# Altium project Optical Compressor.PrjPcb (part 2 of 2)

## Sheet Power.SchDoc
size A4; SheetNumber: 5; SheetTotal: 7; SPICEModelCacheJCDLMQBD: <root> / <DocumentId>JCDLMQBD</DocumentId> / </root>
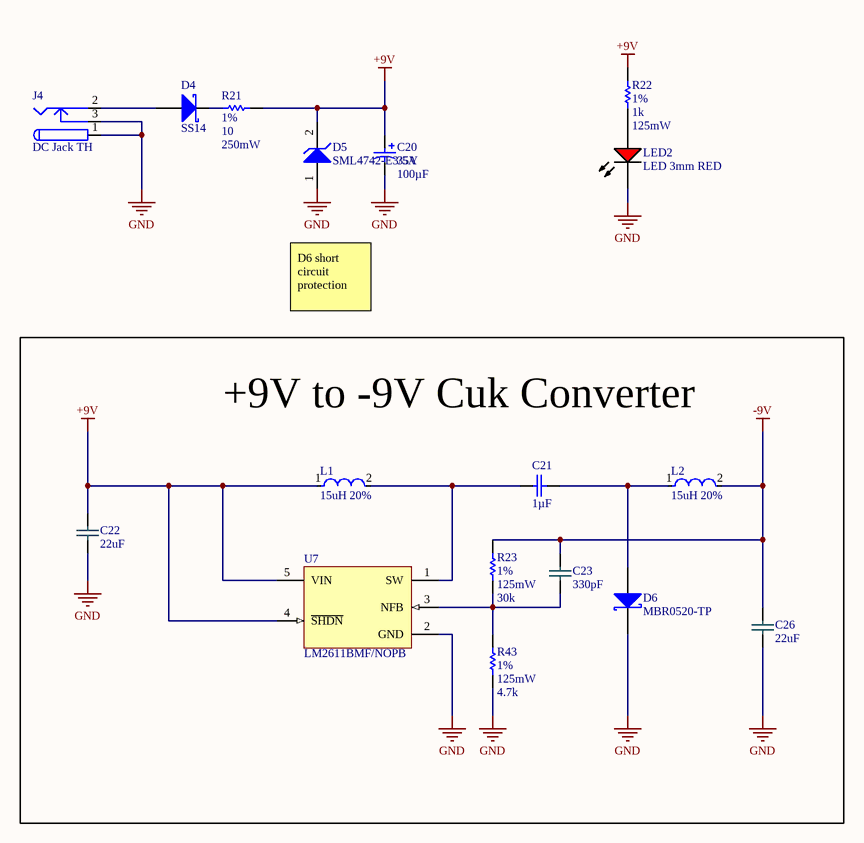
[diagram p4: Power.SchDoc]

### Parts
C20  Rated Voltage: 35V  Capacitance: 100µF  [E-CAP, SMT, diameter 6.3mm, height 7.7mm]  (hidden comment: Cap pol 100µF 35V)
C21  Capacitance: 1µF  [0805-CAP]  (hidden comment: Cap 1µF 0805 X7R)
C22  value 22uF  [1206-CAP]  (hidden comment: Cap 1206 22uF)
C23  value 330pF  [0603-CAP]  (hidden comment: Cap 0603 330pF)
C26  value 22uF  [1206-CAP]  (hidden comment: Cap 1206 22uF)
D4  SS14  [SS14]
D5  SML4742-E3/5A  [DO-214AC]
D6  MBR0520-TP  [SODFL370X135-2N]
J4  DC Jack TH  [DC_Jack]
L1  15uH 20%  [1210 SMD Cap]
L2  15uH 20%  [1210 SMD Cap]
LED2  LED 3mm RED  [KING-WP710A10QBCD_V]
R21  Tolerance (+-): 1%  Resistance: 10  Power: 250mW  [1206-RES]  (hidden comment: Res 10R 1% 1206)
R22  Tolerance (+-): 1%  Resistance: 1k  Power: 125mW  [0805-RES]  (hidden comment: Res 1k 1% 0805)
R23  Tolerance (+-): 1%  Power: 125mW  Resistance: 30k  [0805-RES]  (hidden comment: Res 30k 1% 0805)
R43  Tolerance (+-): 1%  Power: 125mW  Resistance: 4.7k  [0805-RES]  (hidden comment: Res 4.7k 1% 0805)
U7  LM2611BMF/NOPB  [DBV0005A_M]

### Blocks framed on the sheet
+9V to -9V Cuk Converter: C21-C23 C26 D6 L1 L2 R23 R43 U7

### Nets
+9V: C20.1 C22.2 D5.2 L1.1 R21.2 R22.2 U7.4(~{SHDN}) U7.5(VIN)
-9V: C23.2 C26.2 L2.2 R23.2
GND: C20.2 C22.1 C26.1 D5.1 D6.2(K) J4.1 J4.3 LED2.2(K) R43.2 U7.2(GND)
NetC21_1: C21.1 L1.2 U7.1(SW)
NetC21_2: C21.2 D6.1(A) L2.1
NetC23_1: C23.1 R23.1 R43.1 U7.3(NFB)
NetD4_A: D4.A J4.2
NetD4_K: D4.K R21.1
NetLED2_1: LED2.1(A) R22.1

### Notes on the sheet
- D6 short circuit protection

### Library data of the parts
C20 = CMP-00119-4: Cap Aluminum 100uF 35V ±20% (6.3x7.7mm) SMD 2000h 85°C; Lifetime @ Max. Temp. (hours): 2000h; - Tolerance: 20%; + Tolerance: 20%; Maximum operating temperature: 85°C
C21 = CMP-04113-3: Cap 1µF 0805 X7R 50V +-10%; Tolerance (+-): 10%; Dielectric: X7R; Maximum operating temperature: 125°C; Height: 1.45mm; Size (Imperial): 0805; Rated Voltage: 50V
C22 C26 = CMP-019-0043-11: 22uF, 25V, X5R, 20%; Source: main.SchLib; Mount: Surface Mount; Tolerance: 20%; Case/Package: 1206; Min Operating Temperature: -55°C; Voltage Rating: 25V; Length: 0.126inch; Voltage Rating (DC): 25V; Thickness: 0.02inch; Dielectric: X5R; Stock 1: 409; Packaging: Tape and Reel; Capacitance: 22uF; Case Code (Metric): 3216; RoHS: Yes; Width: 0.063inch; Max Operating Temperature: 85°C; Case Code (Imperial): 1206; Pricing 1: 1 = 0.72000, 10 = 0.51900, 50 = 0.51900, 100 = 0.34200, 1000 = 0.21500, 10000 = 0.15900 (USD); Design Item ID: Cap 1206 22uF
C23 = CMP-019-0066-14: 330pF,  5%,  50V,  C0G; Dielectric Material: Ceramic; Temperature Coefficient: 30ppm/°C; Dissipation Factor: 0.5%; Tolerance: 5%; REACH SVHC: No SVHC; RoHS: Yes; Contact Material: Tin; Height: 0.8mm; Package Quantity: 1; ComponentLink5URL: https://datasheet.ciiva.com/14597/70095383-14597551.pdf?src-supplier=Allied+Electronics; Width: 0.8mm; Lead Pitch: 0.7mm; ComponentLink2Description: https://datasheet.ciiva.com/14589/70095383-14589452.pdf?src-supplier=Allied+Electronics; Max Operating Temperature: 125°C; Radiation Hardening: No; Voltage Rating: 50V; Dielectric: C0G; ComponentLink4Description: https://datasheet.ciiva.com/7823/kem-c1003-c0g-smd-7823742.pdf?src-supplier=Element14; Case Code (Metric): 1608; ComponentLink2URL: https://datasheet.ciiva.com/14589/70095383-14589452.pdf?src-supplier=Allied+Electronics; Lead Free: Lead Free; Termination: SMD/SMT; Capacitance: 330pF; Stock 1: 158995; ComponentLink3Description: https://datasheet.ciiva.com/7823/kem-c1003-c0g-smd-7823741.pdf?src-supplier=Element14; Number of Pins: 2; Thickness: 0.034inch; Contact Plating: Tin,Matte; ComponentLink1Description: https://datasheet.ciiva.com/144/docfinderpartnumber-c0603c331j5gactu-144424.pdf?src-supplier=Digi-Key; ComponentLink5Description: https://datasheet.ciiva.com/14597/70095383-14597551.pdf?src-supplier=Allied+Electronics; Mount: Surface Mount,PCB; Packaging: Tape and Reel; ComponentLink4URL: https://datasheet.ciiva.com/7823/kem-c1003-c0g-smd-7823742.pdf?src-supplier=Element14; Pricing 1: 1=0,100000, 10=0,039000, 100=0,027000, 500=0,020000, 1000=0,016000, 4000=0,011000 (USD); Source: main.SchLib; ComponentLink3URL: https://datasheet.ciiva.com/7823/kem-c1003-c0g-smd-7823741.pdf?src-supplier=Element14; Design Item ID: Cap 0603 330pF; Depth: 0.8mm; Length: 1.6mm; Case Code (Imperial): 0603; Case/Package: 0603; Voltage: 50V; Min Operating Temperature: -55°C; Voltage Rating (DC): 50V; ComponentLink1URL: https://datasheet.ciiva.com/144/docfinderpartnumber-c0603c331j5gactu-144424.pdf?src-supplier=Digi-Key
D4 = CMP-029-0000-5: ON SEMICONDUCTOR - SS14 - DIODE, SCHOTTKY, 1A, 40V, DO-214AC-2; Manufacturer: ON Semiconductor / Fairchild; Forward Voltage: 500mV; Max Forward Surge Current (Ifsm): 40A; Polarity: Standard; Power Dissipation: 1.1W; Element Configuration: Single; Peak Reverse Current: 200uA; Number of Elements: 1; Average Rectified Current: 1A; ComponentLink2URL: https://datasheet.ciiva.com/8303/ss19-8303766.pdf?src-supplier=Avnet; Source: main.SchLib; Mount: Surface Mount; ComponentLink4URL: https://datasheet.ciiva.com/7965/1766303-7965241.pdf?src-supplier=Element14; Termination: SMD/SMT; Height: 2.2mm; Lead Free: Lead Free; Packaging: Tape and Reel; Max Reverse Voltage (DC): 40V; Voltage Rating (DC): 40V; REACH SVHC: No SVHC; ComponentLink7Description: https://datasheet.ciiva.com/910/ss12-910697.pdf?src-supplier=Digi-Key; Current: 1A; Number of Pins: 2; ComponentLink8Description: https://datasheet.ciiva.com/22651/1880990-22651980.pdf?src-supplier=Element14; Radiation Hardening: No; Case/Package: SMA; ComponentLink1URL: https://datasheet.ciiva.com/4713/ss14-197224-4713938.pdf?src-supplier=Mouser; Number of Terminals: 2; ComponentLink6Description: https://datasheet.ciiva.com/25951/ss19-25951496.pdf?src-supplier=Avnet+Europe; Manufacturer Part Number: SS14; ComponentLink1Description: https://datasheet.ciiva.com/4713/ss14-197224-4713938.pdf?src-supplier=Mouser; Forward Current: 1A; Max Repetitive Reverse Voltage (Vrrm): 40V; ComponentLink3URL: https://datasheet.ciiva.com/910/ss12-910695.pdf?src-supplier=Digi-Key; Max Operating Temperature: 125°C; Output Current: 1A; Peak Non-Repetitive Surge Current: 40A; Stock 1: 302709; ComponentLink6URL: https://datasheet.ciiva.com/25951/ss19-25951496.pdf?src-supplier=Avnet+Europe; ComponentLink2Description: https://datasheet.ciiva.com/8303/ss19-8303766.pdf?src-supplier=Avnet; Current Rating: 1A; ComponentLink3Description: https://datasheet.ciiva.com/910/ss12-910695.pdf?src-supplier=Digi-Key; Voltage: 40V; ComponentLink8URL: https://datasheet.ciiva.com/22651/1880990-22651980.pdf?src-supplier=Element14; Pricing 1: 1 = 0,42000, 10 = 0,29400, 50 = 0,29400, 100 = 0,13500, 1000 = 0,10400, 10000 = 0,08100 (USD); ComponentLink4Description: https://datasheet.ciiva.com/7965/1766303-7965241.pdf?src-supplier=Element14; Length: 4.75mm; ComponentLink7URL: https://datasheet.ciiva.com/910/ss12-910697.pdf?src-supplier=Digi-Key; Min Operating Temperature: -65°C; Max Power Dissipation: 1.1W; Design Item ID: SS14; ComponentLink5URL: https://datasheet.ciiva.com/910/ss12-910696.pdf?src-supplier=Digi-Key; Width: 2.95mm; RoHS: Yes; ComponentLink5Description: https://datasheet.ciiva.com/910/ss12-910696.pdf?src-supplier=Digi-Key; Weight: 0.003739oz; Package Quantity: 7500
D5 = CMP-029-0015-3: 12V Zener; Manufacturer: Vishay Semiconductors; Impedance: 9R; Power Dissipation: 1W; Tolerance: 10%; Element Configuration: Single; Max Reverse Leakage Current: 5uA; ComponentLink3Description: http://www.vishay.com/docs/85782/sml4728.pdf?src-supplier=Avnet; Package Quantity: 7500; Source: main.SchLib; ComponentLink2Description: http://www.mouser.com/ds/2/427/sml4728-67952.pdf?src-supplier=Mouser; Manufacturer Part Number: SML4742-E3/5A; Mount: Surface Mount; RoHS: Yes; Max Power Dissipation: 1W; Number of Pins: 2; ComponentLink1URL: https://media.digikey.com/pdf/Data%20Sheets/Vishay%20Siliconix%20PDFs/SML4728-SML4764A.pdf?src-supplier=Digi-Key; Radiation Hardening: No; ComponentLink1Description: https://media.digikey.com/pdf/Data%20Sheets/Vishay%20Siliconix%20PDFs/SML4728-SML4764A.pdf?src-supplier=Digi-Key; Stock 1: 7485; ComponentLink2URL: http://www.mouser.com/ds/2/427/sml4728-67952.pdf?src-supplier=Mouser; Packaging: Tape and Reel; Voltage Tolerance: 10%; Min Operating Temperature: -65°C; Pricing 1: 1 = 0,50000, 10 = 0,42600, 25 = 0,39760, 100 = 0,31800, 250 = 0,29524, 500 = 0,24982, 1000 = 0,19305, 2500 = 0,17602 (USD); Case/Package: SMA; Design Item ID: SML4742-E3/5A; Zener Voltage: 12V; Mouser part: 78-SML4742-E3/5A; ComponentLink3URL: http://www.vishay.com/docs/85782/sml4728.pdf?src-supplier=Avnet; Max Operating Temperature: 150°C
D6 = CMP-055-0006-A.3: Rectifier Diode, Schottky, 1 Phase, 1 Element, 0.5A, 20V V(RRM), Silicon
J4 = CMP-034-0002-1: Low Voltage Power Supply Connector; Darkglass part: D00-0019; Selective Soldering: Yes; ComponentLink1Description: Manufacturer Link; Design Item ID: DC Jack TH; Source: main.SchLib; ComponentLink1URL: http://domino.kycon.com/internet/Products.html; Supplied by Darkglass: Yes
L1 L2 = CMP-027-0005-1: Fixed Inductors 15uH 20% 0.48ohm 0.98A AEC-Q200
LED2 = CMP-036-0000-2: THT LED round mono-color waterclear, WL-TMRW , RED; PartNumber: 151034rs03000; Manufacturer: Wuerth Elektronik; Darkglass part: D00-0042; Available Preview Images: 2D; Selective Soldering: YES; ComponentLink2URL: http://katalog.we-online.de/pbs/datasheet/7448042001.pdfhttp://katalog.we-online.de/pbs/datasheet/7448042001.pdfhttp://katalog.we-online.de/pbs/datasheet/7448042001.pdfhttp://katalog.we-online.de/pbs/datasheet/151033BS03000.pdf; Fitted: Fitted; Emitting color: RED; ComponentLink1URL: http://www.we-online.com; Design Item ID: LED 3mm RED; Supplied by Darkglass: YES; Source: main.SchLib; ComponentLink1Description: Manufacturer URL; Mouser part: 710-151034RS03000; PackageReference: Type 3mm; ComponentLink2Description: Datasheet; Darkglass: D00-0042
R21 = CMP-02882-2: Resistor 10R +-1% 1206 Thin film 0.25W +-50ppm/°C; Temperature Coefficient (ppm/°C): 50; Maximum working voltage: 200V; Composition: Thin film; Size (Imperial): 1206
R22 = CMP-02472-2: Resistor 1k +-1% 0805 Thin film 0.125W +-50ppm/°C; Temperature Coefficient (ppm/°C): 50; Maximum working voltage: 150V; Composition: Thin film; Size (Imperial): 0805
R23 = CMP-02638-2: Resistor 30k +-1% 0805 Thin film 0.125W +-50ppm/°C; Maximum working voltage: 150V; Temperature Coefficient (ppm/°C): 50; Composition: Thin film; Size (Imperial): 0805
R43 = CMP-02548-2: Resistor 4.7k +-1% 0805 Thin film 0.125W +-50ppm/°C; Temperature Coefficient (ppm/°C): 50; Maximum working voltage: 150V; Composition: Thin film; Size (Imperial): 0805
U7 = CMP-0069-01166-3: 1.4MHz Cuk Converter, 5-pin SOT-23, Pb-Free; Manufacturer: Texas Instruments; PackageTopMarking: S40B*XTT; PowerWise: N; CompType: Switcher; ComponentLink1URL: http://www.ti.com/general/docs/lit/getliterature.tsp?genericPartNumber=LM2611&fileType=pdf; RoHS: Y; PinCount: 5; PackageReference: DBV0005A; PackageDescription: Molded SOT-23, .115 x .063 x .040 in Body, 5 Lead, .0375 in Pitch; ComponentLink1Description: Datasheet URL

## Sheet Multiband XOver filter.SchDoc
size A4; SheetNumber: 6; SheetTotal: 7
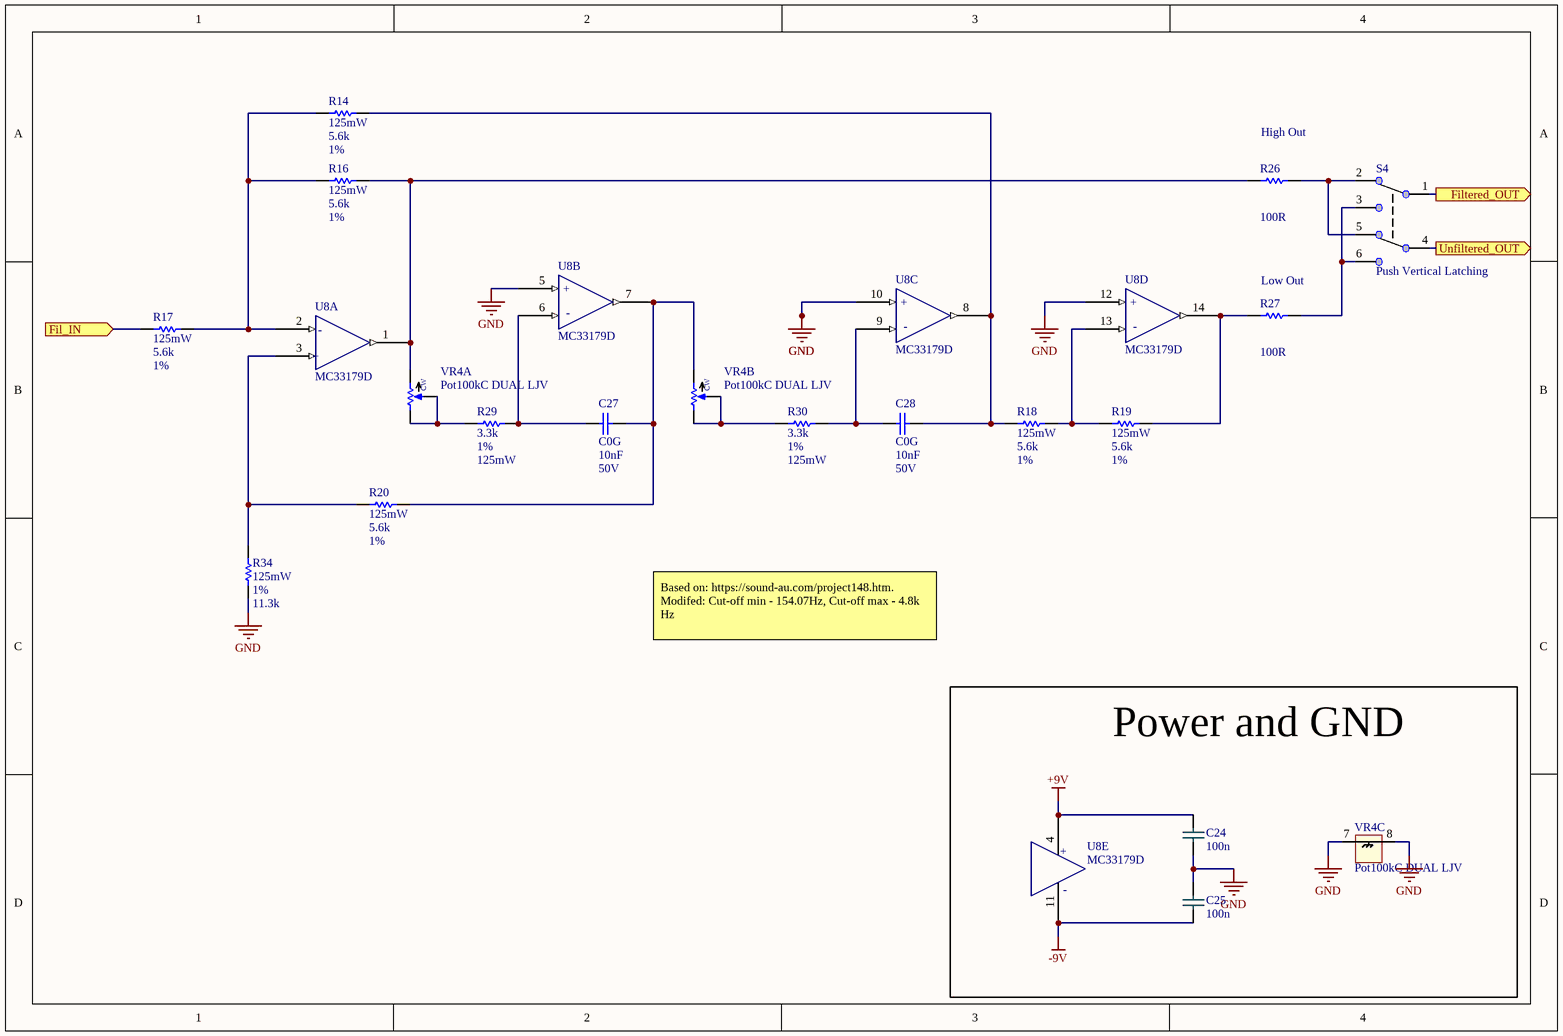
[diagram p5: Multiband XOver filter.SchDoc]

### Parts
C24  value 100n  [0805-CAP]  (hidden comment: Cap 0805 100nF 4)
C25  value 100n  [0805-CAP]  (hidden comment: Cap 0805 100nF 4)
C27  Dielectric: C0G  Capacitance: 10nF  Rated Voltage: 50V  [0805-CAP]  (hidden comment: Cap 10nF 0805 C0G)
C28  Dielectric: C0G  Capacitance: 10nF  Rated Voltage: 50V  [0805-CAP]  (hidden comment: Cap 10nF 0805 C0G)
R14  Power: 125mW  Resistance: 5.6k  Tolerance (+-): 1%  [0805-RES]  (hidden comment: Res 5.6k 1% 0805)
R16  Power: 125mW  Resistance: 5.6k  Tolerance (+-): 1%  [0805-RES]  (hidden comment: Res 5.6k 1% 0805)
R17  Power: 125mW  Resistance: 5.6k  Tolerance (+-): 1%  [0805-RES]  (hidden comment: Res 5.6k 1% 0805)
R18  Power: 125mW  Resistance: 5.6k  Tolerance (+-): 1%  [0805-RES]  (hidden comment: Res 5.6k 1% 0805)
R19  Power: 125mW  Resistance: 5.6k  Tolerance (+-): 1%  [0805-RES]  (hidden comment: Res 5.6k 1% 0805)
R20  Power: 125mW  Resistance: 5.6k  Tolerance (+-): 1%  [0805-RES]  (hidden comment: Res 5.6k 1% 0805)
R26  Resistance: 100R  [0805-RES]  (hidden comment: Res 0805 100R 1%)
R27  Resistance: 100R  [0805-RES]  (hidden comment: Res 0805 100R 1%)
R29  Resistance: 3.3k  Tolerance (+-): 1%  Power: 125mW  [0805-RES]  (hidden comment: Res 3.3k 1% 0805)
R30  Resistance: 3.3k  Tolerance (+-): 1%  Power: 125mW  [0805-RES]  (hidden comment: Res 3.3k 1% 0805)
R34  Power: 125mW  Tolerance (+-): 1%  Resistance: 11.3k  [0805-RES]  (hidden comment: Res 11.3k 1% 0805)
S4  Push Vertical Latching  [PUSH VERTICAL DPDT]
U8  MC33179D  [SOIC14-127P600X175-14N]  (parts A,B,C,D,E of 5)
VR4  Pot100kC DUAL LJV  [LJV 9MM DUAL]  (parts A,B,C of 3)

### Blocks framed on the sheet
Power and GND: C24 C25 U8 VR4

### Ports
Fil_IN (in), Filtered_OUT (out), Unfiltered_OUT (out)

### Nets
+9V: C24.2 U8.4
-9V: C25.1 U8.11
GND: C24.1 C25.2 R34.2 U8.5 U8.10 U8.12 VR4.7 VR4.8
NetC27_1: C27.1 R29.2 U8.6
NetC27_2: C27.2 R20.2 U8.7 VR4.6(CWPIN)
NetC28_1: C28.1 R30.2 U8.9
NetC28_2: C28.2 R14.2 R18.1 U8.8
NetC32_1: S4.4 ; port Unfiltered_OUT
NetR14_1: R14.1 R16.1 R17.2 U8.2
NetR16_2: R16.2 R26.2 U8.1 VR4.3(CWPIN)
NetR17_1: R17.1 ; port Fil_IN
NetR18_2: R18.2 R19.1 U8.13
NetR19_2: R19.2 R27.2 U8.14
NetR20_1: R20.1 R34.1 U8.3
NetR26_1: R26.1 S4.2 S4.5
NetR27_1: R27.1 S4.3 S4.6
NetR29_1: R29.1 VR4.1(CCWPIN) VR4.2(WIPER)
NetR30_1: R30.1 VR4.4(CCWPIN) VR4.5(WIPER)
NetS1_2: S4.1 ; port Filtered_OUT

### Notes on the sheet
- (near R26) High Out
- (near R27) Low Out
- Based on: https://sound-au.com/project148.htm. Modifed: Cut-off min - 154.07Hz, Cut-off max - 4.8k Hz
- (in symbol CMP-028-0019-6, part A) -; +
- (in symbol CMP-028-0019-6, part B) +; -
- (in symbol CMP-028-0019-6, part C) +; -
- (in symbol CMP-028-0019-6, part D) +; -
- (in symbol CMP-028-0019-6, part E) +; -
- (in symbol CMP-028-0097-4, part A) CW
- (in symbol CMP-028-0097-4, part B) CW

### Library data of the parts
C24 C25 = CMP-019-0144-11: 0.1uF 25volts C0G 5%; Source: main.SchLib; PackageDescription: Chip Capacitor; LatestRevisionNote: IPC-7351 Footprint Added.; LatestRevisionDate: 29-May-2009; Publisher: Altium Limited; Published: 8-Jun-2000; Mouser part: 81-GRM31C5C1E104JA01; Design Item ID: Cap 0805 100nF 4; PackageReference: C1206; Fitted: Fitted
C27 C28 = CMP-04096-2: Cap 10nF 0805 C0G 50V +-5%; Tolerance (+-): 5%; Maximum operating temperature: 125°C; Height: 950µm; Size (Imperial): 0805
R14 R16-R20 = CMP-02557-2: Resistor 5.6k +-1% 0805 Thin film 0.125W +-50ppm/°C; Maximum working voltage: 150V; Temperature Coefficient (ppm/°C): 50; Composition: Thin film; Size (Imperial): 0805
R26 R27 = CMP-037-0118-8: 100ohm, 125mW, 1%, thin film; Temperature Coefficient: 50ppm/°C; Voltage Rating (DC): 150V; Composition: Thin Film; Case/Package: 0805; Case Code (Imperial): 0805; Case Code (Metric): 2012; ComponentLink1Description: https://datasheet.ciiva.com/2560/pyu-rt-1-to-0-05-rohs-l-5-2560883.pdf?src-supplier=Digi-Key; ComponentLink1URL: https://datasheet.ciiva.com/2560/pyu-rt-1-to-0-05-rohs-l-5-2560883.pdf?src-supplier=Digi-Key; ComponentLink2Description: https://datasheet.ciiva.com/5624/pyu-rt-1-to-0-05-rohs-l-4-5624374.pdf?src-supplier=Mouser; ComponentLink2URL: https://datasheet.ciiva.com/5624/pyu-rt-1-to-0-05-rohs-l-4-5624374.pdf?src-supplier=Mouser; ComponentLink3Description: https://datasheet.ciiva.com/7942/442970-7942070.pdf?src-supplier=Element14; ComponentLink3URL: https://datasheet.ciiva.com/7942/442970-7942070.pdf?src-supplier=Element14; ComponentLink4Description: https://datasheet.ciiva.com/5925/442970-5925320.pdf?src-supplier=Farnell; ComponentLink4URL: https://datasheet.ciiva.com/5925/442970-5925320.pdf?src-supplier=Farnell; Contact Plating: Tin; Depth: 1.25mm; Design Item ID: Res 0805 100R 1%; Features: Moisture Resistant; Height: 0.024inch; LatestRevisionDate: 17-Jul-2002; LatestRevisionNote: Re-released for DXP Platform.; Lead Free: Lead Free; Length: 2mm; Max Operating Temperature: 125°C; Max Power Dissipation: 125mW; Military Standard: Not; Min Operating Temperature: -55°C; Number of Pins: 2; Number of Terminations: 2; PackageDescription: Axial Device, Thru-Hole; 2 Leads; 0.5 in Pin Spacing; Package Quantity: 5000; PackageReference: AXIAL-0.5; Packaging: Tape and Reel; Power Rating: 125mW; Pricing 1: 1 = 0,10000, 10 = 0,09300, 100 = 0,03580, 1000 = 0,01573, 2500 = 0,01358 (USD); Published: 8-Jun-2000; Publisher: Altium Limited; Radiation Hardening: No; REACH SVHC: No SVHC; RoHS: Yes; Source: main.SchLib; Stock 1: 52567; Termination: SMD/SMT; Tolerance: 1%; Value: 100R; Voltage Rating: 150V; Weight: 0.000194oz; Width: 0.049inch
R29 R30 = CMP-02529-2: Resistor 3.3k +-1% 0805 Thin film 0.125W +-50ppm/°C; Maximum working voltage: 150V; Temperature Coefficient (ppm/°C): 50; Composition: Thin film; Size (Imperial): 0805
R34 = CMP-02591-2: Resistor 11.3k +-1% 0805 Thin film 0.125W +-50ppm/°C; Maximum working voltage: 150V; Temperature Coefficient (ppm/°C): 50; Size (Imperial): 0805; Composition: Thin film
S4 = CMP-028-0063-7: DPDT Pushbutton Latching; Manufacturer Part Number: TL2201EEXA; Darkglass part: D00-0005; Manufacturer: E-Switch; Electrical Life: 10000Cycles; Voltage Rating (DC): 30V; Supplied by Darkglass: YES; Actuator Length: 3mm; Operating Force: 2.16N; Current Rating: 100mA; Switch Function: On-On; ComponentLink2URL: https://datasheet.ciiva.com/16156/p010350f-16156301.pdf?src-supplier=Onlinecomponents.com; Termination: PC Pin; Design Item ID: Push Vertical; Source: main.SchLib; Max Voltage Rating (DC): 30V; RoHS: Yes; Orientation: Straight; Stock 1: 351; ComponentLink1URL: https://datasheet.ciiva.com/2879/p010350g-2879559.pdf?src-supplier=Digi-Key; Throw Configuration: DPDT; Lead Free: Lead Free; ComponentLink1Description: https://datasheet.ciiva.com/2879/p010350g-2879559.pdf?src-supplier=Digi-Key; Package Quantity: 700; ComponentLink2Description: https://datasheet.ciiva.com/16156/p010350f-16156301.pdf?src-supplier=Onlinecomponents.com; Contact Material: Silver; Selective Soldering: YES; Packaging: Bulk; Mount: Through Hole; Pricing 1: 1=0,70000, 10=0,66300, 25=0,63400, 50=0,60400, 100=0,58900, 250=0,57400, 500=0,54500, 1000=0,51500, 2500=0,49200, 10000=0,49200 (USD)
U8 = CMP-028-0019-6: Operational Amplifiers - Op Amps 2-18V Quad Low Power Industrial Temp SOIC14; Manufacturer Part Number: MC33179DR2G; Manufacturer: ON Semiconductor; Max Dual Supply Voltage: 18V; Bandwidth: 5MHz; Common Mode Rejection Ratio: 80dB; Min Dual Supply Voltage: 2V; Number of Amplifiers: 4; Slew Rate: 2V/µs; Input Bias Current: 500nA; Voltage Gain: 106.02dB; Operating Supply Current: 1.7mA; Output Current: 80mA; Input Offset Voltage (Vos): 3mV; Output Current per Channel: 100mA; ComponentLink2Description: https://datasheet.ciiva.com/5787/89824-5787686.pdf?src-supplier=Farnell; ComponentLink12URL: http://datasheet.octopart.com/MC33179DR2G-ON-Semiconductor-datasheet-82522822.pdf?src-supplier=Newark; Min Operating Temperature: -40°C; Pricing 1: 1 = 0.97000, 10 = 0.86300, 100 = 0.67300, 500 = 0.55598, 1000 = 0.43893 (USD); Case/Package: SOIC; Stock 1: 2859; Width: 4mm; Lead Free: Lead Free; ComponentLink11URL: http://datasheet.octopart.com/MC33179DR2G-ON-Semiconductor-datasheet-14137761.pdf?src-supplier=IIIC; ComponentLink3Description: https://datasheet.ciiva.com/26056/mc33178-d-26056822.pdf?src-supplier=Avnet+Europe; ComponentLink4URL: https://datasheet.ciiva.com/1796/mc33178-d-1796957.pdf?src-supplier=Digi-Key; Length: 8.75mm; Mouser part: 863-MC33179DR2G; REACH SVHC: No SVHC; ComponentLink11Description: http://datasheet.octopart.com/MC33179DR2G-ON-Semiconductor-datasheet-14137761.pdf?src-supplier=IIIC; Max Operating Temperature: 85°C; ComponentLink8URL: https://datasheet.ciiva.com/8078/89824-8078570.pdf?src-supplier=Element14; ComponentLink6URL: https://datasheet.ciiva.com/2973/mc33178-d-2973668.pdf?src-supplier=Avnet; ComponentLink3URL: https://datasheet.ciiva.com/26056/mc33178-d-26056822.pdf?src-supplier=Avnet+Europe; Gain Bandwidth Product: 5MHz; Nominal Gain Bandwidth Product: 5MHz; ComponentLink1Description: https://datasheet.ciiva.com/30481/0900766b81276f1b-30481445.pdf?src-supplier=RSComponents; Number of Channels: 4; ComponentLink8Description: https://datasheet.ciiva.com/8078/89824-8078570.pdf?src-supplier=Element14; ComponentLink7Description: https://datasheet.ciiva.com/16212/mc33178-d-16212327.pdf?src-supplier=Future+Electronics; ComponentLink12Description: http://datasheet.octopart.com/MC33179DR2G-ON-Semiconductor-datasheet-82522822.pdf?src-supplier=Newark; ComponentLink7URL: https://datasheet.ciiva.com/16212/mc33178-d-16212327.pdf?src-supplier=Future+Electronics; ComponentLink5URL: https://datasheet.ciiva.com/1796/mc33178-d-1796959.pdf?src-supplier=Digi-Key; ComponentLink1URL: https://datasheet.ciiva.com/30481/0900766b81276f1b-30481445.pdf?src-supplier=RSComponents; ComponentLink5Description: https://datasheet.ciiva.com/1796/mc33178-d-1796959.pdf?src-supplier=Digi-Key; Power Supply Rejection Ratio (PSRR): 80dB; Number of Pins: 14; Unity Gain Bandwidth Product: 5MHz; ComponentLink6Description: https://datasheet.ciiva.com/2973/mc33178-d-2973668.pdf?src-supplier=Avnet; Radiation Hardening: No; Contact Plating: Tin; Package Quantity: 2500; Number of Elements: 4; Nominal Supply Current: 1.7mA; Source: main.SchLib; Packaging: Tape and Reel; Design Item ID: MC33179D; Number of Circuits: 4; ComponentLink4Description: https://datasheet.ciiva.com/1796/mc33178-d-1796957.pdf?src-supplier=Digi-Key; Max Supply Voltage: 18V; ComponentLink9URL: https://datasheet.ciiva.com/1796/mc33178-d-1796958.pdf?src-supplier=Digi-Key; ComponentLink10Description: http://datasheet.octopart.com/MC33179DR2G-ON-Semiconductor-datasheet-164248.pdf?src-supplier=Newark; Height: 1.5mm; Halogen Free: Halogen Free; ComponentLink2URL: https://datasheet.ciiva.com/5787/89824-5787686.pdf?src-supplier=Farnell; ComponentLink10URL: http://datasheet.octopart.com/MC33179DR2G-ON-Semiconductor-datasheet-164248.pdf?src-supplier=Newark; ComponentLink9Description: https://datasheet.ciiva.com/1796/mc33178-d-1796958.pdf?src-supplier=Digi-Key
VR4 = CMP-028-0097-4: Dual gang rev log pot; Supplied by Darkglass: YES; Value: 100kC; SET POSITION: 1; Source: main.SchLib; Design Item ID: Pot100kC DUAL LJV; Selective Soldering: YES

## Sheet Sum.SchDoc
size A4; SheetNumber: 7; SheetTotal: 7
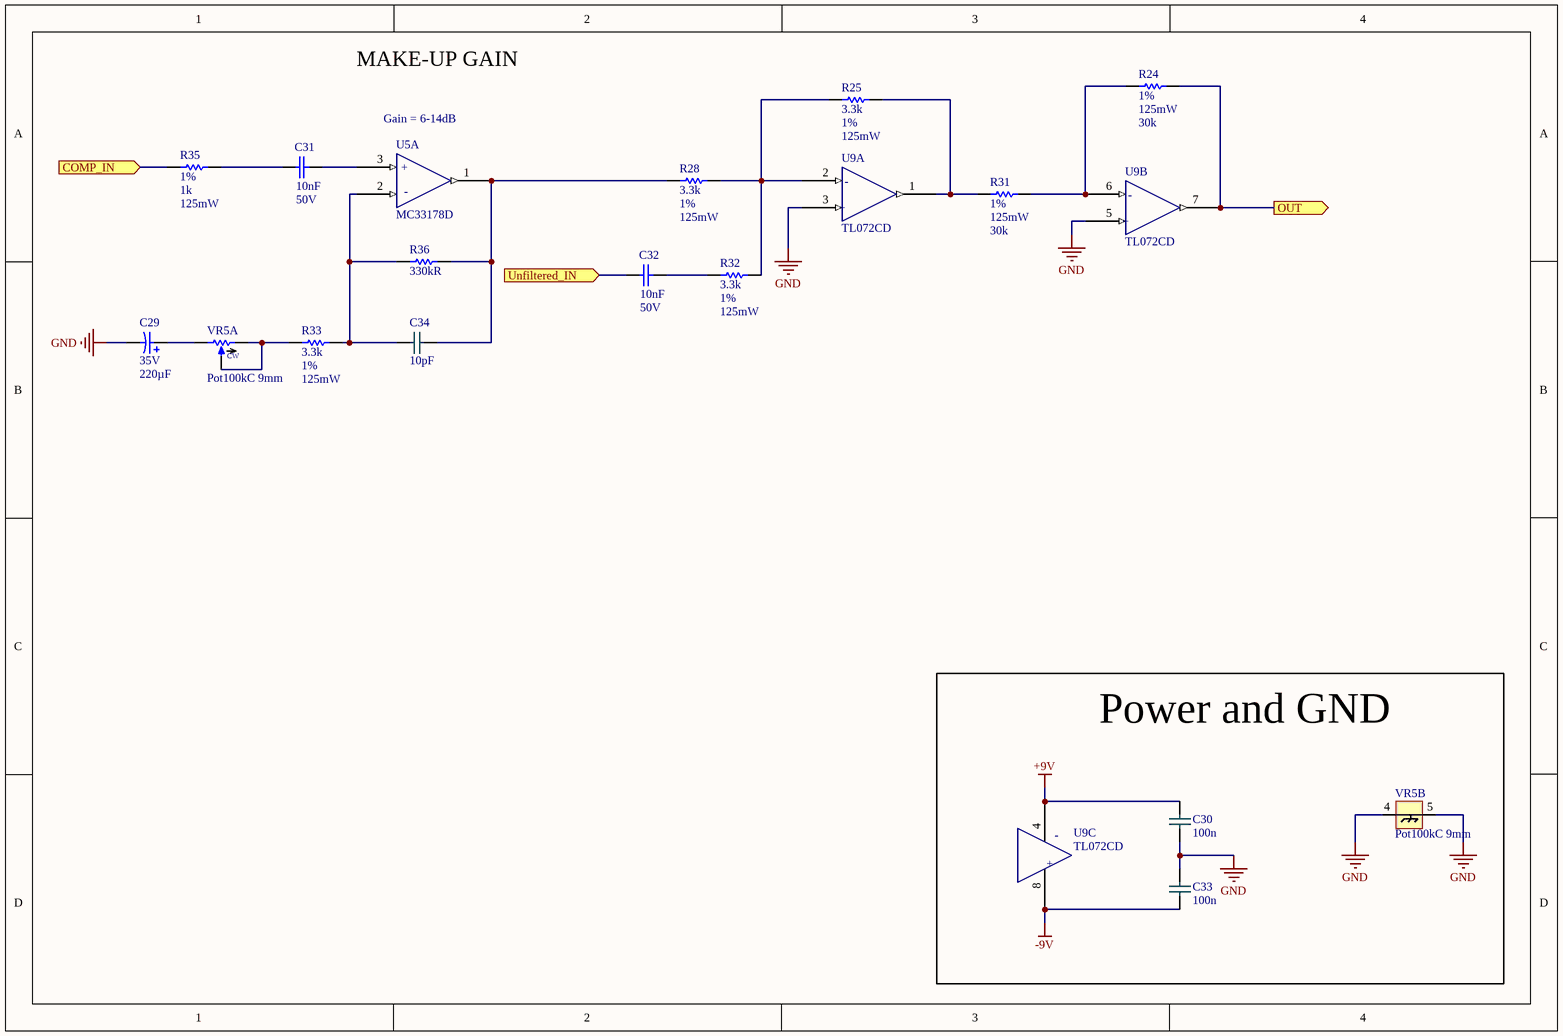
[diagram p6: Sum.SchDoc]

### Parts
C29  Rated Voltage: 35V  Capacitance: 220µF  [E-CAP, SMT, diameter 10mm, height 10.2mm]  (hidden comment: Cap pol 220µF 35V)
C30  value 100n  [0805-CAP]  (hidden comment: Cap 0805 100nF 4)
C31  Capacitance: 10nF  Rated Voltage: 50V  [0805-CAP]  (hidden comment: Cap 10nF 0805 C0G)
C32  Capacitance: 10nF  Rated Voltage: 50V  [0805-CAP]  (hidden comment: Cap 10nF 0805 C0G)
C33  value 100n  [0805-CAP]  (hidden comment: Cap 0805 100nF 4)
C34  Capacitance: 10pF  [0805-CAP]  (hidden comment: cap 0805 10pF)
R24  Tolerance (+-): 1%  Power: 125mW  Resistance: 30k  [0805-RES]  (hidden comment: Res 30k 1% 0805)
R25  Resistance: 3.3k  Tolerance (+-): 1%  Power: 125mW  [0805-RES]  (hidden comment: Res 3.3k 1% 0805)
R28  Resistance: 3.3k  Tolerance (+-): 1%  Power: 125mW  [0805-RES]  (hidden comment: Res 3.3k 1% 0805)
R31  Tolerance (+-): 1%  Power: 125mW  Resistance: 30k  [0805-RES]  (hidden comment: Res 30k 1% 0805)
R32  Resistance: 3.3k  Tolerance (+-): 1%  Power: 125mW  [0805-RES]  (hidden comment: Res 3.3k 1% 0805)
R33  Resistance: 3.3k  Tolerance (+-): 1%  Power: 125mW  [0805-RES]  (hidden comment: Res 3.3k 1% 0805)
R35  Tolerance (+-): 1%  Resistance: 1k  Power: 125mW  [0805-RES]  (hidden comment: Res 1k 1% 0805)
R36  Resistance: 330kR  [0805-RES]  (hidden comment: Res 0805 330k 1%)
U5  MC33178D  [SOIC8-127P600X175-8N]  (part A of 3)
U9  TL072CD  [SOIC8-127P600X175-8N]  (parts A,B,C of 3)
VR5  Pot100kC 9mm  [LJV 9mm pot]  (parts A,B of 2)

### Blocks framed on the sheet
Power and GND: C30 C33 U9 VR5

### Ports
COMP_IN (in), OUT (out), Unfiltered_IN (in)

### Nets
+9V: C30.2 U9.4(V-)
-9V: C33.1 U9.8(V+)
GND: C29.2 C30.1 C33.2 U9.3(IN+) U9.5(IN+) VR5.4 VR5.5
NetC11_2: R35.1 ; port COMP_IN
NetC29_1: C29.1 VR5.1(CCWPIN)
NetC31_1: C31.1 R35.2
NetC31_2: C31.2 U5.3
NetC32_1: C32.1 ; port Unfiltered_IN
NetC32_2: C32.2 R32.1
NetC34_1: C34.1 R33.2 R36.1 U5.2
NetC34_2: C34.2 R28.1 R36.2 U5.1
NetR24_1: R24.1 R31.1 U9.6(IN-)
NetR24_2: R24.2 U9.7 ; port OUT
NetR25_1: R25.1 R28.2 R32.2 U9.2(IN-)
NetR25_2: R25.2 R31.2 U9.1(OUT)
NetR33_1: R33.1 VR5.2(WIPER) VR5.3(CWPIN)

### Notes on the sheet
- MAKE-UP GAIN
- (near U5) Gain = 6-14dB
- (in symbol CMP-028-0012-7, part A) -; +
- (in symbol CMP-028-0012-7, part B) -; +
- (in symbol CMP-028-0012-7, part C) -; +
- (in symbol CMP-028-0053-5, part A) CW
- (in symbol CMP-032-0003-7, part A) +; -

### Library data of the parts
C29 = CMP-00120-4: Cap Aluminum 220uF 35V ±20% (10x10.2mm) SMD 2000h 85°C; Maximum operating temperature: 85°C; Lifetime @ Max. Temp. (hours): 2000h; + Tolerance: 20%; - Tolerance: 20%
C30 C33 = CMP-019-0144-11: 0.1uF 25volts C0G 5%; Source: main.SchLib; PackageDescription: Chip Capacitor; LatestRevisionNote: IPC-7351 Footprint Added.; LatestRevisionDate: 29-May-2009; Publisher: Altium Limited; Published: 8-Jun-2000; Mouser part: 81-GRM31C5C1E104JA01; Design Item ID: Cap 0805 100nF 4; PackageReference: C1206; Fitted: Fitted
C31 C32 = CMP-04096-2: as C27 on sheet Multiband XOver filter; Dielectric: C0G; Maximum operating temperature: 125°C; Height: 950µm; Size (Imperial): 0805
C34 = CMP-019-0194-1: Ceramic Capacitor, Multilayer, Ceramic, 25V, 5% +Tol, 5% -Tol, C0G, -/+30ppm/Cel TC, 0.00001uF, Surface Mount, 0805; Manufacturer Series: VJ; Multilayer: Yes; JESD-609 Code: e3; Size Code: 0805; Terminal Finish: Tin; Termination: Wraparound; Negative Tolerance: 5%; Max Operating Temperature: 125°C; RoHS Compliant: Yes; REACH SVHC: Yes; Capacitor Type: Ceramic; Positive Tolerance: 5%; Mount: Surface Mount; Packaging: Tape and Reel; Package Shape: Rectangular; Dielectric Material: Ceramic; Temperature Characteristics Code: C0G; Rated DC Voltage (URdc): 25V; Min Operating Temperature: -55°C; Number of Pins: 2
R24 R31 = CMP-02638-2: as R23 on sheet Power; Composition: Thin film; Size (Imperial): 0805
R25 R28 R32 R33 = CMP-02529-2: as R29 on sheet Multiband XOver filter; Composition: Thin film; Size (Imperial): 0805
R35 = CMP-02472-2: as R22 on sheet Power; Composition: Thin film; Size (Imperial): 0805
R36 = CMP-037-0126-8: 330kohm, 125mW, 1%, thin film; Temperature Coefficient: 50ppm/°C; Voltage Rating (DC): 150V; Composition: Thin Film; Case/Package: 0805; Case Code (Imperial): 0805; Case Code (Metric): 2012; ComponentLink1Description: https://datasheet.ciiva.com/5990/1392914-5990598.pdf?src-supplier=Farnell; ComponentLink1URL: https://datasheet.ciiva.com/5990/1392914-5990598.pdf?src-supplier=Farnell; ComponentLink2Description: https://datasheet.ciiva.com/5990/1392914-5990601.pdf?src-supplier=Farnell; ComponentLink2URL: https://datasheet.ciiva.com/5990/1392914-5990601.pdf?src-supplier=Farnell; ComponentLink3Description: https://datasheet.ciiva.com/2561/pyu-rt-1-to-0-05-rohs-l-5-2561162.pdf?src-supplier=Digi-Key; ComponentLink3URL: https://datasheet.ciiva.com/2561/pyu-rt-1-to-0-05-rohs-l-5-2561162.pdf?src-supplier=Digi-Key; Contact Plating: Tin; Depth: 1.25mm; Design Item ID: Res 0805 330k 1%; Height: 0.024inch; LatestRevisionDate: 17-Jul-2002; LatestRevisionNote: Re-released for DXP Platform.; Lead Free: Lead Free; Length: 0.079inch; Max Operating Temperature: 125°C; Max Power Dissipation: 125mW; Military Standard: Not; Min Operating Temperature: -55°C; Number of Pins: 2; Number of Terminations: 2; PackageDescription: Axial Device, Thru-Hole; 2 Leads; 0.5 in Pin Spacing; Package Quantity: 5000; PackageReference: AXIAL-0.5; Packaging: Tape and Reel; Power Rating: 125mW; Pricing 1: 1 = 0,10000, 10 = 0,09300, 100 = 0,03580, 1000 = 0,01573, 2500 = 0,01358 (USD); Published: 8-Jun-2000; Publisher: Altium Limited; Radiation Hardening: No; REACH SVHC: No SVHC; RoHS: Yes; Source: main.SchLib; Stock 1: 1168; Termination: SMD/SMT; Tolerance: 1%; Value: 330k; Voltage Rating: 150V; Width: 0.049inch
U5 = CMP-032-0003-7: IC OPAMP GP 5MHZ 8SOIC; Manufacturer: ON Semiconductor; Manufacturer Part Number: MC33178DR2G; Slew Rate: 2V/µs; Max Supply Voltage: 18V; Input Bias Current: 500nA; Number of Elements: 2; Output Current: 80mA; Nominal Supply Current: 900uA; Operating Supply Current: 1.7mA; Min Dual Supply Voltage: 2V; Common Mode Rejection Ratio: 80dB; Max Frequency: 100kHz; Input Offset Voltage (Vos): 3mV; Voltage Gain: 106.02dB; Output Current per Channel: 100mA; ComponentLink3Description: https://datasheet.ciiva.com/1796/mc33178-d-1796436.pdf?src-supplier=Digi-Key; Contact Plating: Tin; Packaging: Tape and Reel; ComponentLink4URL: https://datasheet.ciiva.com/8078/89824-8078566.pdf?src-supplier=Element14; ComponentLink1Description: https://datasheet.ciiva.com/30481/0900766b811a6563-30481352.pdf?src-supplier=RSComponents; Number of Pins: 8; Width: 0.157inch; ComponentLink6URL: https://datasheet.ciiva.com/2973/mc33178-d-2973665.pdf?src-supplier=Avnet; Nominal Gain Bandwidth Product: 5MHz; Min Operating Temperature: -40°C; Design Item ID: MC33178D; Lead Free: Lead Free; Max Dual Supply Voltage: 18V; ComponentLink9Description: https://datasheet.ciiva.com/26056/mc33178-d-26056808.pdf?src-supplier=Avnet+Europe; ComponentLink8URL: https://datasheet.ciiva.com/17068/70275428-17068423.pdf?src-supplier=Allied+Electronics; Length: 0.196inch; Gain Bandwidth Product: 5MHz; ComponentLink9URL: https://datasheet.ciiva.com/26056/mc33178-d-26056808.pdf?src-supplier=Avnet+Europe; Stock 1: 25846; Number of Channels: 2; Number of Amplifiers: 2; ComponentLink6Description: https://datasheet.ciiva.com/2973/mc33178-d-2973665.pdf?src-supplier=Avnet; ComponentLink5URL: https://datasheet.ciiva.com/48491/mc33178-d-48491755.pdf?src-supplier=Avnet; Mouser part: 863-MC33178DG; Case/Package: SOIC; Height: 0.059inch; ComponentLink5Description: https://datasheet.ciiva.com/48491/mc33178-d-48491755.pdf?src-supplier=Avnet; ComponentLink2URL: https://datasheet.ciiva.com/1796/mc33178-d-1796435.pdf?src-supplier=Digi-Key; Radiation Hardening: No; ComponentLink2Description: https://datasheet.ciiva.com/1796/mc33178-d-1796435.pdf?src-supplier=Digi-Key; ComponentLink8Description: https://datasheet.ciiva.com/17068/70275428-17068423.pdf?src-supplier=Allied+Electronics; Package Quantity: 1; ComponentLink1URL: https://datasheet.ciiva.com/30481/0900766b811a6563-30481352.pdf?src-supplier=RSComponents; Halogen Free: Halogen Free; Unity Gain Bandwidth Product: 5MHz; ComponentLink3URL: https://datasheet.ciiva.com/1796/mc33178-d-1796436.pdf?src-supplier=Digi-Key; ComponentLink4Description: https://datasheet.ciiva.com/8078/89824-8078566.pdf?src-supplier=Element14; Max Operating Temperature: 85°C; REACH SVHC: No SVHC; ComponentLink7Description: https://datasheet.ciiva.com/1796/mc33178-d-1796437.pdf?src-supplier=Digi-Key; Pricing 1: 1 = 0.86000, 10 = 0.75300, 100 = 0.57700, 500 = 0.45614, 1000 = 0.36492 (USD); ComponentLink7URL: https://datasheet.ciiva.com/1796/mc33178-d-1796437.pdf?src-supplier=Digi-Key; RoHS: Yes; Source: main.SchLib; Bandwidth: 5MHz; Number of Circuits: 2; Power Supply Rejection Ratio (PSRR): 80dB; PartId: 1
U9 = CMP-028-0012-7: Operational Amplifiers - Op Amps Dual Low Noise JFET SOIC8; Manufacturer 1: Texas Instruments; Operating Supply Voltage: 18V; Number of Elements: 2; Bandwidth: 3MHz; Dual Supply Voltage: 9V; Input Bias Current: 200pA; Min Dual Supply Voltage: 3.5V; Voltage Gain: 106.02dB; Max I/O Voltage: 10mV; Common Mode Rejection Ratio: 70dB; Input Offset Voltage (Vos): 3mV; Slew Rate: 13V/µs; Operating Supply Current: 1.4mA; Nominal Supply Current: 5mA; ComponentLink4URL: http://www.farnell.com/datasheets/1862384.pdf?src-supplier=Element14; ComponentLink4Description: http://www.farnell.com/datasheets/1862384.pdf?src-supplier=Element14; Manufacturer Part Number 1: TL072CD; REACH SVHC: No SVHC; Pricing 1: 1 = 0.71000, 10 = 0.59500, 50 = 0.59500, 100 = 0.38400, 1000 = 0.30700, 10000 = 0.25000 (USD); RoHS: Yes; Source: main.SchLib; ComponentLink1URL: http://www.ti.com/general/docs/lit/getliterature.tsp?genericPartNumber=TL072&&fileType=pdf&src-supplier=Avnet; Height: 1.58mm; Gain Bandwidth Product: 3MHz; ComponentLink5URL: http://focus.ti.com/lit/ds/symlink/tl074.pdf?src-supplier=Avnet+Asia; Number of Amplifiers: 2; ComponentLink2Description: https://www.distrelec.biz/Web/Downloads/_t/ds/tl07x-series_eng_tds.pdf?mime=application%2Fpdf&src-supplier=Distrelec; Radiation Hardening: No; ComponentLink3URL: http://www.ti.com/lit/ds/symlink/tl071a.pdf?src-supplier=Digi-Key; Unity Gain Bandwidth Product: 3MHz; Case/Package: D; Max Operating Temperature: 85°C; Packaging: Rail/Tube; Number of Circuits: 2; Number of Pins: 8; Length: 4.9mm; Number of Channels: 2; Package Quantity: 75; Min Operating Temperature: -40°C; Width: 3.91mm; Lead Free: Lead Free; Stock 1: 14514; ComponentLink3Description: http://www.ti.com/lit/ds/symlink/tl071a.pdf?src-supplier=Digi-Key; Nominal Gain Bandwidth Product: 3MHz; ComponentLink5Description: http://focus.ti.com/lit/ds/symlink/tl074.pdf?src-supplier=Avnet+Asia; Max Dual Supply Voltage: 18V; ComponentLink1Description: http://www.ti.com/general/docs/lit/getliterature.tsp?genericPartNumber=TL072&&fileType=pdf&src-supplier=Avnet; ComponentLink2URL: https://www.distrelec.biz/Web/Downloads/_t/ds/tl07x-series_eng_tds.pdf?mime=application%2Fpdf&src-supplier=Distrelec; Design Item ID: TL072CD
VR5 = CMP-028-0053-5: LJV 9mm pot; Darkglass part: D00-0002; Manufacturer Part Number 1: RP09110NOBA-H02-1485 (C104,KA15A6.5); Value: 100kC; Selective Soldering: YES; SET POSITION: 1; Source: main.SchLib; Design Item ID: Pot100kC 9mm; Supplied by Darkglass: YES

## Nets that join several sheets
+9V: Pre-amp (5 pins), Compressor and Sidechain (C13.2 C14.2 U3.8 U4.8), Out (C18.2 C35.2 U5.8 U6.8), Power (8 pins), Multiband XOver filter (C24.2 U8.4), Sum (C30.2 U9.4)
-9V: Pre-amp (5 pins), Compressor and Sidechain (C15.1 C16.1 U3.4 U4.4), Out (C19.1 C36.1 U5.4 U6.4), Power (C23.2 C26.2 L2.2 R23.2), Multiband XOver filter (C25.1 U8.11), Sum (C33.1 U9.8)
GND: Pre-amp (12 pins), Compressor and Sidechain (14 pins), Out (17 pins), Power (10 pins), Multiband XOver filter (8 pins), Sum (7 pins)
NetC3_2: Main (S1.1), Pre-amp (C3.2 S2.2)
NetC11_2: Compressor and Sidechain (C11.2 VR2.1), Sum (R35.1)
NetC32_1: Multiband XOver filter (S4.4), Sum (C32.1)
NetR17_1: Main (S1.3), Multiband XOver filter (R17.1)
NetR24_2: Out (VR3.3), Sum (R24.2 U9.7)
NetS1_2: Main (S1.2), Compressor and Sidechain (U1.5), Multiband XOver filter (S4.1)
NetS2_1: Pre-amp (S2.1 U1.1 U1.2), Out (VR3.1)